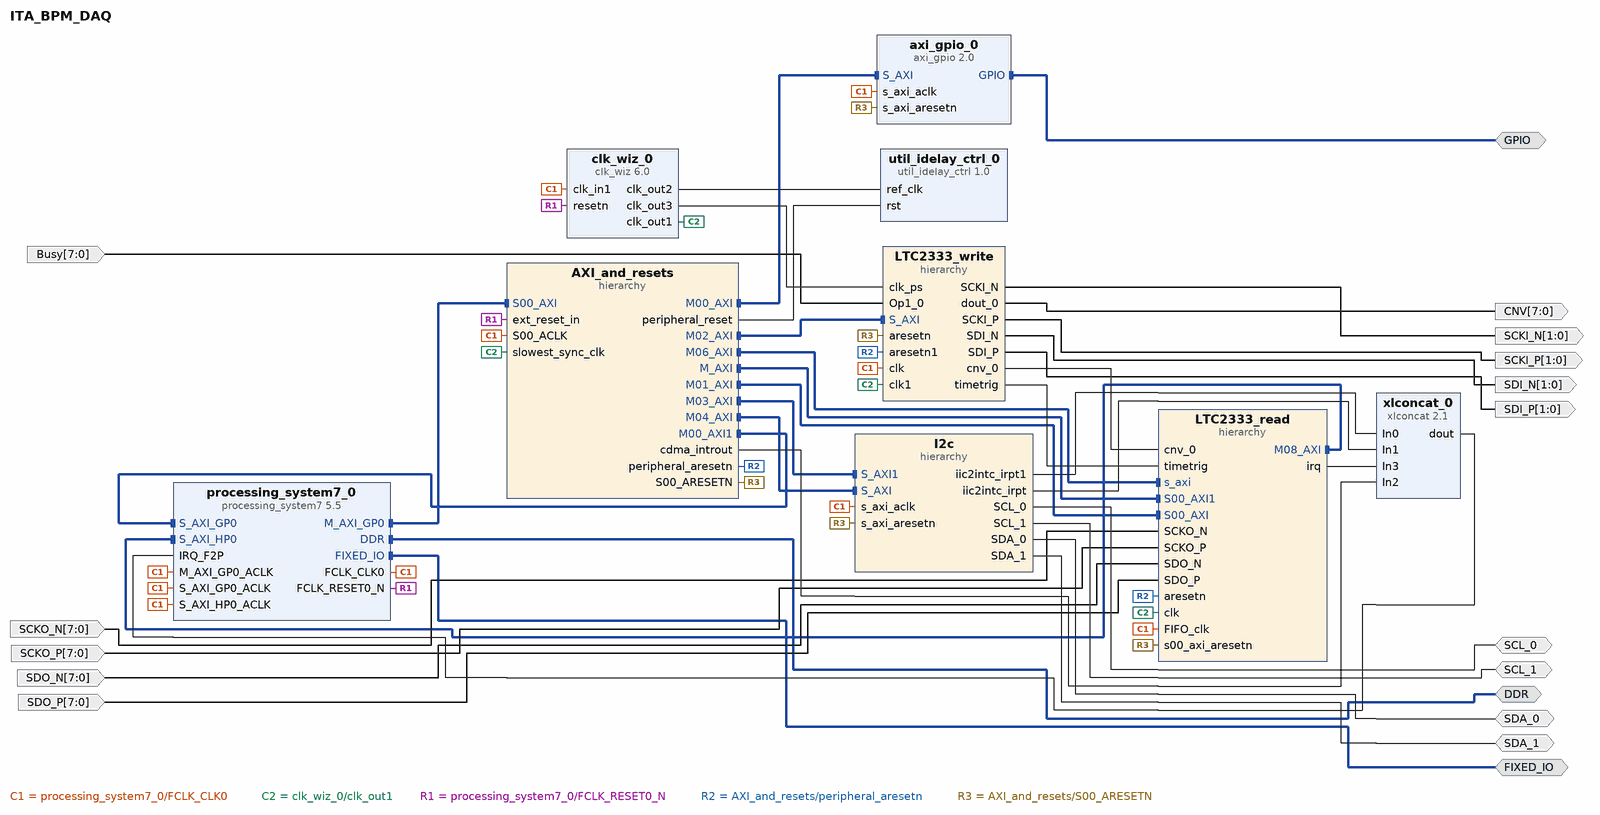
[diagram p0: block diagram of the top level]
# Vivado block design ITA_BPM_DAQ, xc7z020clg484-1, Vivado 2021.2
create_bd_design ITA_BPM_DAQ

create_bd_intf_port -mode Master -vlnv xilinx.com:interface:ddrx_rtl:1.0 DDR
create_bd_intf_port -mode Master -vlnv xilinx.com:display_processing_system7:fixedio_rtl:1.0 FIXED_IO
create_bd_intf_port -mode Master -vlnv xilinx.com:interface:gpio_rtl:1.0 GPIO
create_bd_port -dir I -from 7 -to 0 Busy
create_bd_port -dir I -from 7 -to 0 SCKO_P
create_bd_port -dir I -from 7 -to 0 SCKO_N
create_bd_port -dir I -from 7 -to 0 SDO_P
create_bd_port -dir I -from 7 -to 0 SDO_N
create_bd_port -dir O -from 1 -to 0 -type clk SCKI_P
create_bd_port -dir O -from 1 -to 0 -type clk SCKI_N
create_bd_port -dir O -from 1 -to 0 -type clk SDI_P
create_bd_port -dir O -from 1 -to 0 -type clk SDI_N
create_bd_port -dir O -from 7 -to 0 CNV
create_bd_port -dir IO SCL_0
create_bd_port -dir IO SDA_0
create_bd_port -dir IO SCL_1
create_bd_port -dir IO SDA_1

create_bd_cell -type ip -vlnv xilinx.com:ip:processing_system7:5.5 processing_system7_0
set_property -dict [list \
  CONFIG.PCW_EN_CLK1_PORT 1 \
  CONFIG.PCW_FCLK_CLK1_BUF TRUE \
  CONFIG.PCW_FPGA0_PERIPHERAL_FREQMHZ 100 \
  CONFIG.PCW_FPGA1_PERIPHERAL_FREQMHZ 33 \
  CONFIG.PCW_FPGA_FCLK1_ENABLE 1 \
  CONFIG.PCW_IRQ_F2P_INTR 1 \
  CONFIG.PCW_USE_FABRIC_INTERRUPT 1 \
  CONFIG.PCW_USE_S_AXI_GP0 1 \
  CONFIG.PCW_USE_S_AXI_HP0 1 \
] [get_bd_cells processing_system7_0]
# 34 more settings of processing_system7_0 are not shown: defaults, MIO pin electricals, DDR timing, and values the tool derives
create_bd_cell -type ip -vlnv xilinx.com:ip:axi_gpio:2.0 axi_gpio_0
set_property -dict {CONFIG.C_ALL_OUTPUTS 1 CONFIG.C_GPIO_WIDTH 6} [get_bd_cells axi_gpio_0]
create_bd_cell -type hier LTC2333_write
create_bd_cell -type hier AXI_and_resets
create_bd_cell -type hier LTC2333_read
create_bd_cell -type ip -vlnv xilinx.com:ip:xlconcat:2.1 xlconcat_0
set_property -dict {CONFIG.NUM_PORTS 4} [get_bd_cells xlconcat_0]
create_bd_cell -type hier I2c
create_bd_cell -type ip -vlnv xilinx.com:ip:clk_wiz:6.0 clk_wiz_0
set_property -dict [list \
  CONFIG.CLKOUT1_JITTER 165.726 \
  CONFIG.CLKOUT1_REQUESTED_OUT_FREQ 33.33333 \
  CONFIG.CLKOUT2_JITTER 114.829 \
  CONFIG.CLKOUT2_PHASE_ERROR 98.575 \
  CONFIG.CLKOUT2_REQUESTED_OUT_FREQ 200.000 \
  CONFIG.CLKOUT2_USED true \
  CONFIG.CLKOUT3_JITTER 165.726 \
  CONFIG.CLKOUT3_PHASE_ERROR 98.575 \
  CONFIG.CLKOUT3_REQUESTED_OUT_FREQ 33.33333 \
  CONFIG.CLKOUT3_REQUESTED_PHASE 90 \
  CONFIG.CLKOUT3_USED true \
  CONFIG.MMCM_CLKOUT0_DIVIDE_F 30.000 \
  CONFIG.MMCM_CLKOUT1_DIVIDE 5 \
  CONFIG.MMCM_CLKOUT2_DIVIDE 30 \
  CONFIG.MMCM_CLKOUT2_PHASE 90.000 \
  CONFIG.NUM_OUT_CLKS 3 \
  CONFIG.RESET_PORT resetn \
  CONFIG.RESET_TYPE ACTIVE_LOW \
] [get_bd_cells clk_wiz_0]
create_bd_cell -type ip -vlnv xilinx.com:ip:util_idelay_ctrl:1.0 util_idelay_ctrl_0

# ---- hierarchy /LTC2333_write ----
current_bd_instance /LTC2333_write
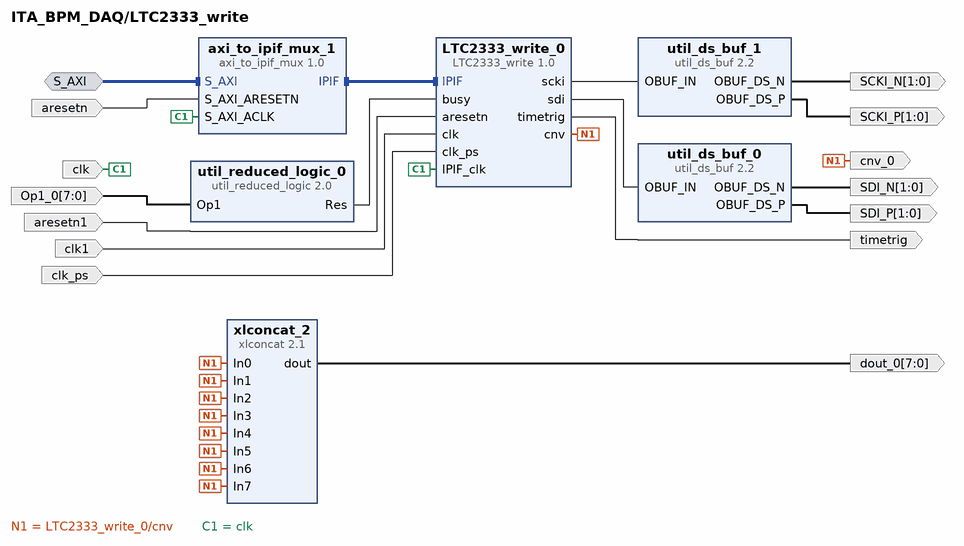
[diagram p1: block diagram inside /LTC2333_write]
create_bd_intf_pin -mode Slave -vlnv xilinx.com:interface:aximm_rtl:1.0 S_AXI
create_bd_pin -dir I -type clk clk
create_bd_pin -dir I -type rst aresetn
create_bd_pin -dir O cnv_0
create_bd_pin -dir I -type rst aresetn1
create_bd_pin -dir I -type clk clk1
create_bd_pin -dir I -from 7 -to 0 Op1_0
create_bd_pin -dir O -from 1 -to 0 -type clk SCKI_P
create_bd_pin -dir O -from 1 -to 0 -type clk SCKI_N
create_bd_pin -dir O -from 1 -to 0 -type clk SDI_P
create_bd_pin -dir O -from 1 -to 0 -type clk SDI_N
create_bd_pin -dir O -from 7 -to 0 dout_0
create_bd_pin -dir I clk_ps
create_bd_pin -dir O timetrig

create_bd_cell -type ip -vlnv user.org:user:axi_to_ipif_mux:1.0 axi_to_ipif_mux_1
set_property -dict {CONFIG.MUX_BY_CHIP false CONFIG.N_CHIP 1} [get_bd_cells axi_to_ipif_mux_1]
create_bd_cell -type ip -vlnv xilinx.com:ip:util_reduced_logic:2.0 util_reduced_logic_0
set_property -dict {CONFIG.C_OPERATION or} [get_bd_cells util_reduced_logic_0]
create_bd_cell -type ip -vlnv xilinx.com:ip:util_ds_buf:2.2 util_ds_buf_0
set_property -dict {CONFIG.C_BUF_TYPE OBUFDS CONFIG.C_SIZE 2} [get_bd_cells util_ds_buf_0]
create_bd_cell -type ip -vlnv xilinx.com:ip:util_ds_buf:2.2 util_ds_buf_1
set_property -dict {CONFIG.C_BUF_TYPE OBUFDS CONFIG.C_SIZE 2} [get_bd_cells util_ds_buf_1]
create_bd_cell -type ip -vlnv xilinx.com:ip:xlconcat:2.1 xlconcat_2
set_property -dict {CONFIG.NUM_PORTS 8} [get_bd_cells xlconcat_2]
create_bd_cell -type ip -vlnv user.org:user:LTC2333_write:1.0 LTC2333_write_0
set_property -dict {CONFIG.BUSY_SIGNAL 0 CONFIG.BUSY_TIME 600 CONFIG.CLOCK_PERIOD 30} [get_bd_cells LTC2333_write_0]

# ---- hierarchy /AXI_and_resets ----
current_bd_instance /AXI_and_resets
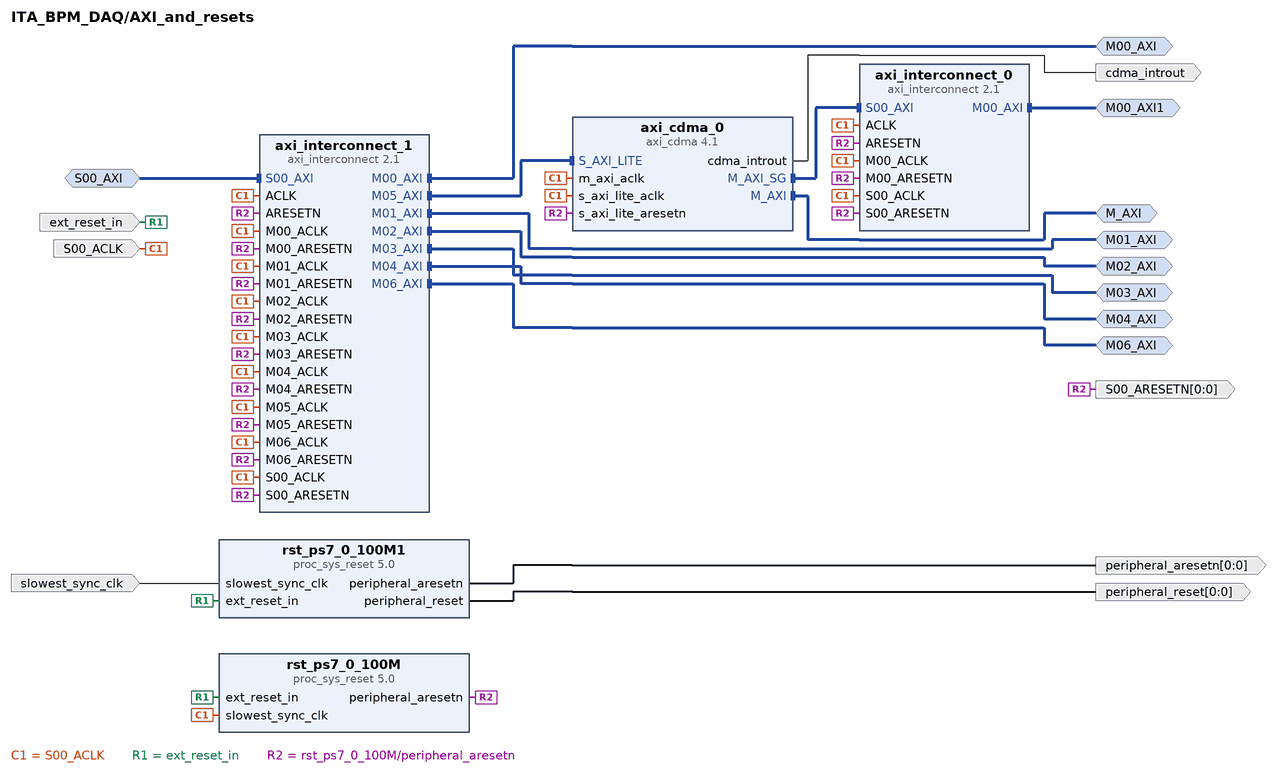
[diagram p2: block diagram inside /AXI_and_resets]
create_bd_intf_pin -mode Master -vlnv xilinx.com:interface:aximm_rtl:1.0 M00_AXI
create_bd_intf_pin -mode Master -vlnv xilinx.com:interface:aximm_rtl:1.0 M01_AXI
create_bd_intf_pin -mode Master -vlnv xilinx.com:interface:aximm_rtl:1.0 M02_AXI
create_bd_intf_pin -mode Master -vlnv xilinx.com:interface:aximm_rtl:1.0 M03_AXI
create_bd_intf_pin -mode Master -vlnv xilinx.com:interface:aximm_rtl:1.0 M04_AXI
create_bd_intf_pin -mode Master -vlnv xilinx.com:interface:aximm_rtl:1.0 M00_AXI1
create_bd_intf_pin -mode Master -vlnv xilinx.com:interface:aximm_rtl:1.0 M_AXI
create_bd_intf_pin -mode Slave -vlnv xilinx.com:interface:aximm_rtl:1.0 S00_AXI
create_bd_intf_pin -mode Master -vlnv xilinx.com:interface:aximm_rtl:1.0 M06_AXI
create_bd_pin -dir I -type clk S00_ACLK
create_bd_pin -dir I -type rst ext_reset_in
create_bd_pin -dir O -from 0 -to 0 -type rst S00_ARESETN
create_bd_pin -dir I -type clk slowest_sync_clk
create_bd_pin -dir O -from 0 -to 0 -type rst peripheral_aresetn
create_bd_pin -dir O -from 0 -to 0 -type rst peripheral_reset
create_bd_pin -dir O -type intr cdma_introut

create_bd_cell -type ip -vlnv xilinx.com:ip:proc_sys_reset:5.0 rst_ps7_0_100M
create_bd_cell -type ip -vlnv xilinx.com:ip:proc_sys_reset:5.0 rst_ps7_0_100M1
create_bd_cell -type ip -vlnv xilinx.com:ip:axi_cdma:4.1 axi_cdma_0
set_property -dict {CONFIG.C_INCLUDE_SF 0 CONFIG.C_M_AXI_MAX_BURST_LEN 32} [get_bd_cells axi_cdma_0]
create_bd_cell -type ip -vlnv xilinx.com:ip:axi_interconnect:2.1 axi_interconnect_0
set_property -dict {CONFIG.NUM_MI 1} [get_bd_cells axi_interconnect_0]
create_bd_cell -type ip -vlnv xilinx.com:ip:axi_interconnect:2.1 axi_interconnect_1
set_property -dict {CONFIG.NUM_MI 7} [get_bd_cells axi_interconnect_1]

# ---- hierarchy /LTC2333_read ----
current_bd_instance /LTC2333_read
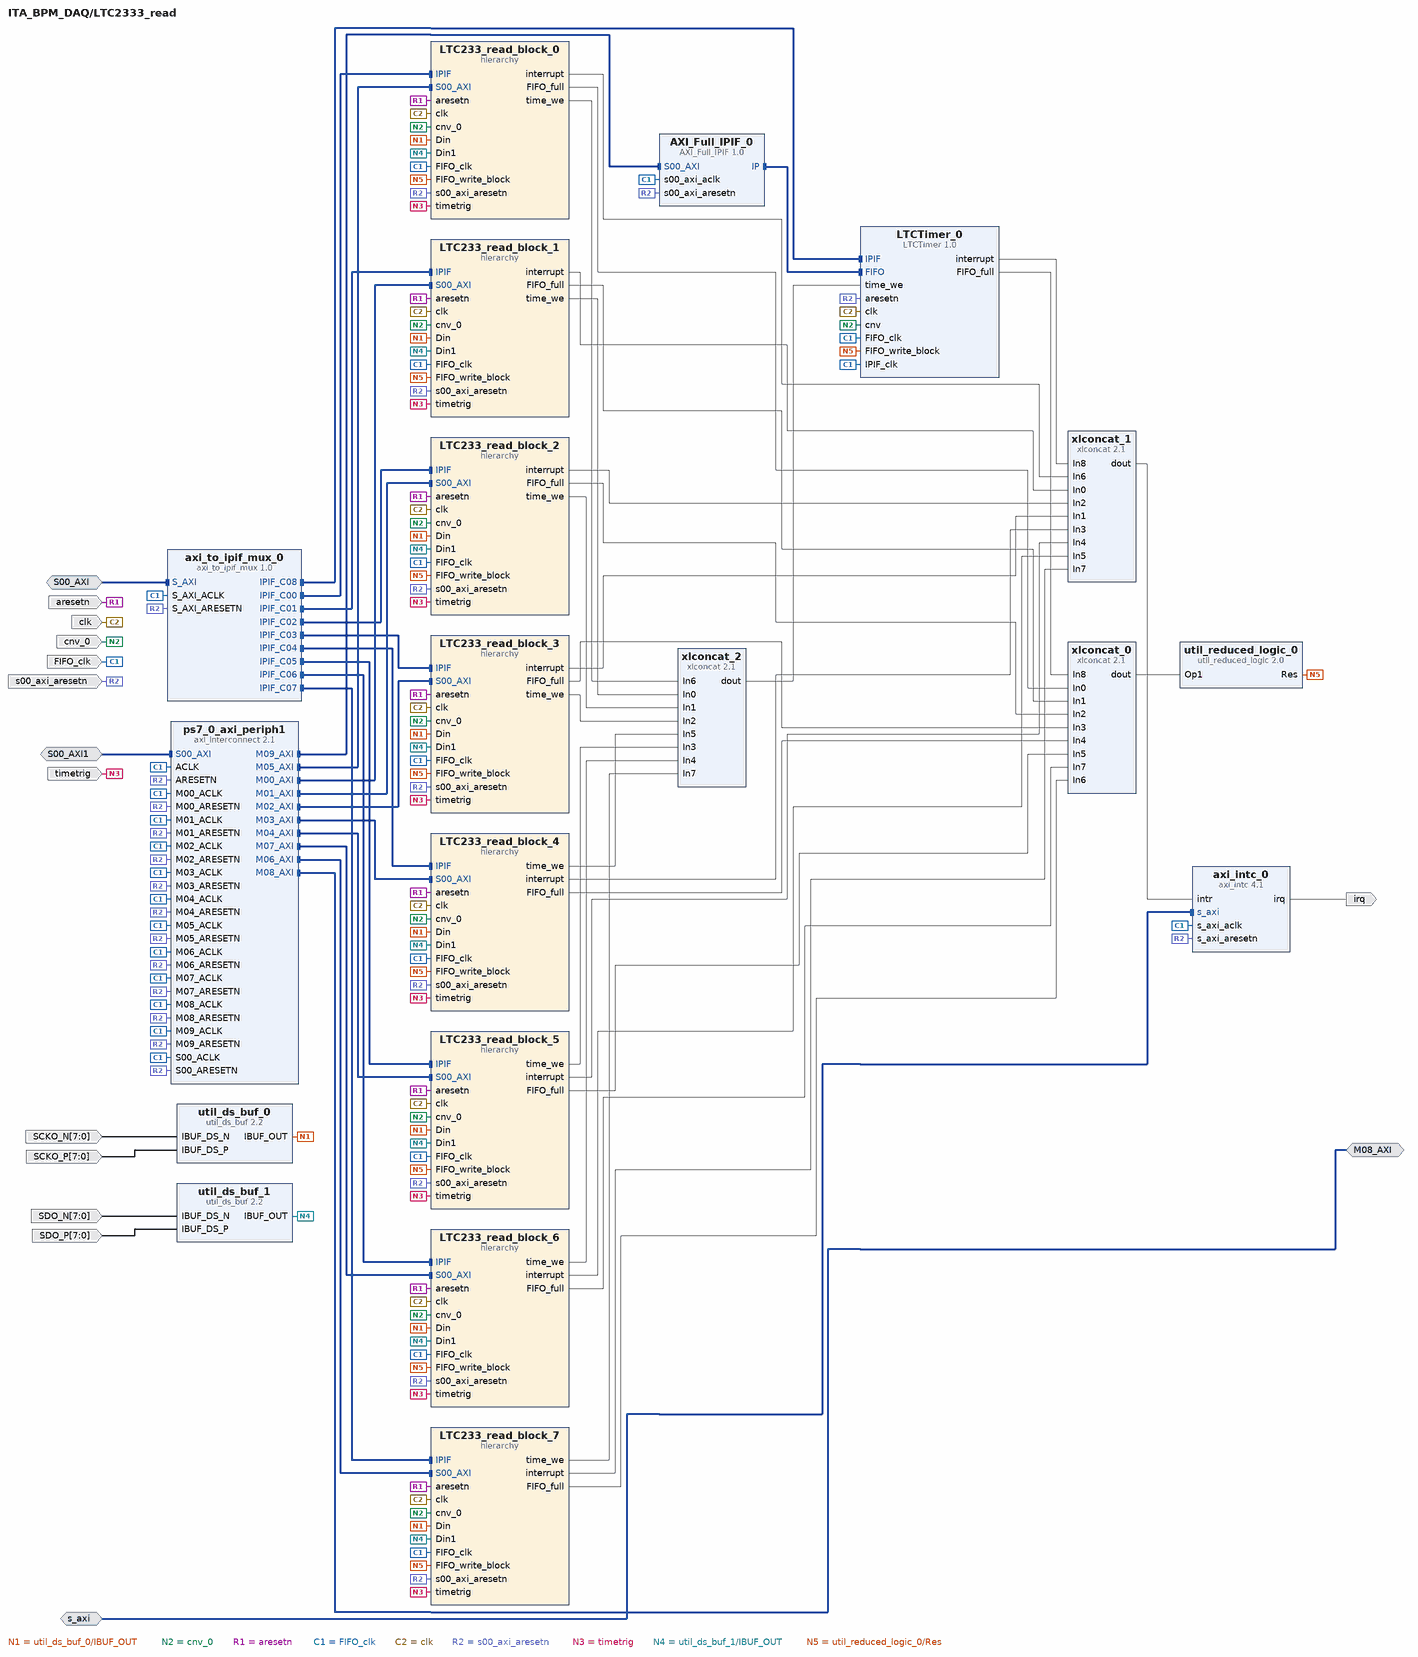
[diagram p3: block diagram inside /LTC2333_read]
create_bd_intf_pin -mode Slave -vlnv xilinx.com:interface:aximm_rtl:1.0 S00_AXI
create_bd_intf_pin -mode Slave -vlnv xilinx.com:interface:aximm_rtl:1.0 S00_AXI1
create_bd_intf_pin -mode Master -vlnv xilinx.com:interface:aximm_rtl:1.0 M08_AXI
create_bd_intf_pin -mode Slave -vlnv xilinx.com:interface:aximm_rtl:1.0 s_axi
create_bd_pin -dir I -type clk FIFO_clk
create_bd_pin -dir I -type rst s00_axi_aresetn
create_bd_pin -dir I -type clk clk
create_bd_pin -dir I cnv_0
create_bd_pin -dir I -type rst aresetn
create_bd_pin -dir I -from 7 -to 0 -type clk SCKO_P
create_bd_pin -dir I -from 7 -to 0 -type clk SCKO_N
create_bd_pin -dir I -from 7 -to 0 -type clk SDO_P
create_bd_pin -dir I -from 7 -to 0 -type clk SDO_N
create_bd_pin -dir I timetrig
create_bd_pin -dir O -type intr irq

create_bd_cell -type ip -vlnv user.org:user:axi_to_ipif_mux:1.0 axi_to_ipif_mux_0
set_property -dict {CONFIG.BROADCAST_REG 13 CONFIG.N_CHIP 9} [get_bd_cells axi_to_ipif_mux_0]
create_bd_cell -type hier LTC233_read_block_0
create_bd_cell -type ip -vlnv xilinx.com:ip:axi_interconnect:2.1 ps7_0_axi_periph1
set_property -dict {CONFIG.NUM_MI 10} [get_bd_cells ps7_0_axi_periph1]
create_bd_cell -type hier LTC233_read_block_2
create_bd_cell -type hier LTC233_read_block_3
create_bd_cell -type hier LTC233_read_block_4
create_bd_cell -type hier LTC233_read_block_5
create_bd_cell -type hier LTC233_read_block_6
create_bd_cell -type hier LTC233_read_block_7
create_bd_cell -type hier LTC233_read_block_1
create_bd_cell -type ip -vlnv xilinx.com:ip:util_reduced_logic:2.0 util_reduced_logic_0
set_property -dict {CONFIG.C_OPERATION or CONFIG.C_SIZE 9} [get_bd_cells util_reduced_logic_0]
create_bd_cell -type ip -vlnv xilinx.com:ip:xlconcat:2.1 xlconcat_0
set_property -dict {CONFIG.NUM_PORTS 9} [get_bd_cells xlconcat_0]
create_bd_cell -type ip -vlnv xilinx.com:ip:util_ds_buf:2.2 util_ds_buf_0
set_property -dict {CONFIG.C_SIZE 8} [get_bd_cells util_ds_buf_0]
create_bd_cell -type ip -vlnv xilinx.com:ip:util_ds_buf:2.2 util_ds_buf_1
set_property -dict {CONFIG.C_SIZE 8} [get_bd_cells util_ds_buf_1]
create_bd_cell -type ip -vlnv user.org:user:AXI_Full_IPIF:1.0 AXI_Full_IPIF_0
create_bd_cell -type ip -vlnv xilinx.com:ip:axi_intc:4.1 axi_intc_0
set_property -dict [list \
  CONFIG.C_HAS_CIE 0 \
  CONFIG.C_HAS_IPR 0 \
  CONFIG.C_HAS_IVR 0 \
  CONFIG.C_HAS_SIE 0 \
  CONFIG.C_IRQ_CONNECTION 1 \
  CONFIG.C_NUM_SW_INTR 0 \
] [get_bd_cells axi_intc_0]
create_bd_cell -type ip -vlnv xilinx.com:ip:xlconcat:2.1 xlconcat_1
set_property -dict {CONFIG.NUM_PORTS 9} [get_bd_cells xlconcat_1]
create_bd_cell -type ip -vlnv xilinx.com:ip:xlconcat:2.1 xlconcat_2
set_property -dict {CONFIG.NUM_PORTS 8} [get_bd_cells xlconcat_2]
create_bd_cell -type ip -vlnv user.org:user:LTCTimer:1.0 LTCTimer_0
set_property -dict {CONFIG.C_S_AXI_DATA_WIDTH 32} [get_bd_cells LTCTimer_0]

# ---- hierarchy /LTC2333_read/LTC233_read_block_0 ----
current_bd_instance /LTC2333_read/LTC233_read_block_0
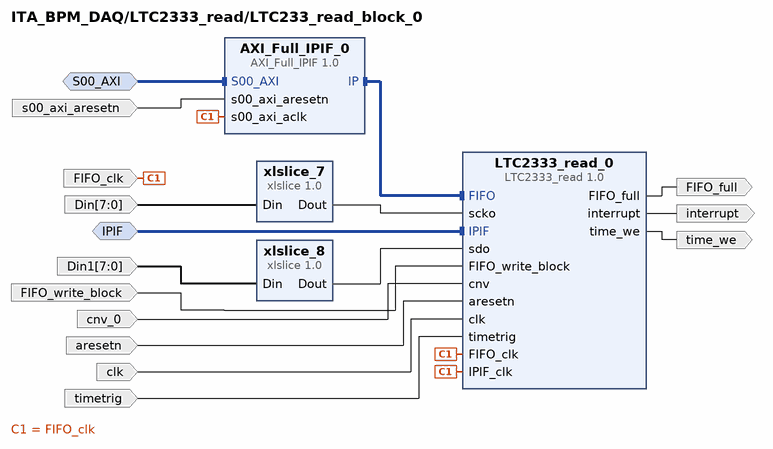
[diagram p4: block diagram inside /LTC2333_read/LTC233_read_block_0]
create_bd_intf_pin -mode Slave -vlnv NONE:user:IPIF_AXISL__rtl:1.0 IPIF
create_bd_intf_pin -mode Slave -vlnv xilinx.com:interface:aximm_rtl:1.0 S00_AXI
create_bd_pin -dir I -type clk clk
create_bd_pin -dir I cnv_0
create_bd_pin -dir I -type clk FIFO_clk
create_bd_pin -dir I -type rst s00_axi_aresetn
create_bd_pin -dir I -type rst aresetn
create_bd_pin -dir O FIFO_full
create_bd_pin -dir I FIFO_write_block
create_bd_pin -dir I -from 7 -to 0 Din
create_bd_pin -dir I -from 7 -to 0 Din1
create_bd_pin -dir I timetrig
create_bd_pin -dir O -type intr interrupt
create_bd_pin -dir O time_we

create_bd_cell -type ip -vlnv user.org:user:AXI_Full_IPIF:1.0 AXI_Full_IPIF_0
create_bd_cell -type ip -vlnv xilinx.com:ip:xlslice:1.0 xlslice_7
set_property -dict {CONFIG.DIN_WIDTH 8} [get_bd_cells xlslice_7]
create_bd_cell -type ip -vlnv xilinx.com:ip:xlslice:1.0 xlslice_8
set_property -dict {CONFIG.DIN_WIDTH 8} [get_bd_cells xlslice_8]
create_bd_cell -type ip -vlnv user.org:user:LTC2333_read:1.0 LTC2333_read_0

# ---- hierarchy /LTC2333_read/LTC233_read_block_2 ----
current_bd_instance /LTC2333_read/LTC233_read_block_2
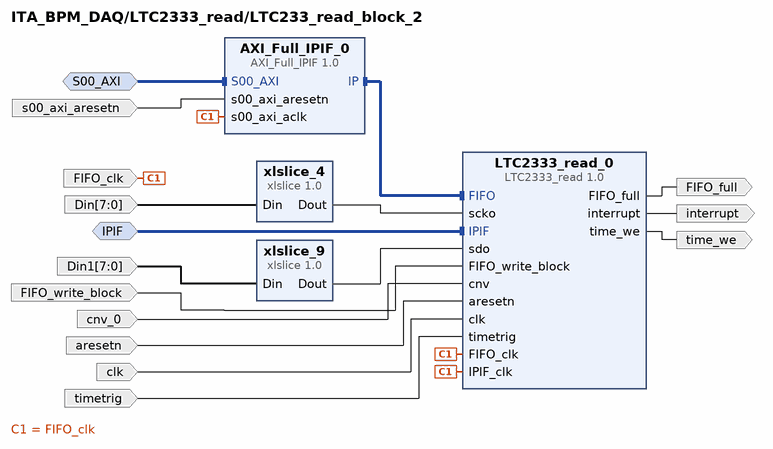
[diagram p5: block diagram inside /LTC2333_read/LTC233_read_block_2]
create_bd_intf_pin -mode Slave -vlnv NONE:user:IPIF_AXISL__rtl:1.0 IPIF
create_bd_intf_pin -mode Slave -vlnv xilinx.com:interface:aximm_rtl:1.0 S00_AXI
create_bd_pin -dir I -type clk clk
create_bd_pin -dir I cnv_0
create_bd_pin -dir I -type clk FIFO_clk
create_bd_pin -dir I -type rst s00_axi_aresetn
create_bd_pin -dir I -type rst aresetn
create_bd_pin -dir O FIFO_full
create_bd_pin -dir I FIFO_write_block
create_bd_pin -dir I -from 7 -to 0 Din
create_bd_pin -dir I -from 7 -to 0 Din1
create_bd_pin -dir I timetrig
create_bd_pin -dir O -type intr interrupt
create_bd_pin -dir O time_we

create_bd_cell -type ip -vlnv user.org:user:AXI_Full_IPIF:1.0 AXI_Full_IPIF_0
create_bd_cell -type ip -vlnv xilinx.com:ip:xlslice:1.0 xlslice_4
set_property -dict {CONFIG.DIN_FROM 1 CONFIG.DIN_TO 1 CONFIG.DIN_WIDTH 8 CONFIG.DOUT_WIDTH 1} [get_bd_cells xlslice_4]
create_bd_cell -type ip -vlnv xilinx.com:ip:xlslice:1.0 xlslice_9
set_property -dict {CONFIG.DIN_FROM 1 CONFIG.DIN_TO 1 CONFIG.DIN_WIDTH 8 CONFIG.DOUT_WIDTH 1} [get_bd_cells xlslice_9]
create_bd_cell -type ip -vlnv user.org:user:LTC2333_read:1.0 LTC2333_read_0

# ---- hierarchy /LTC2333_read/LTC233_read_block_3 ----
current_bd_instance /LTC2333_read/LTC233_read_block_3
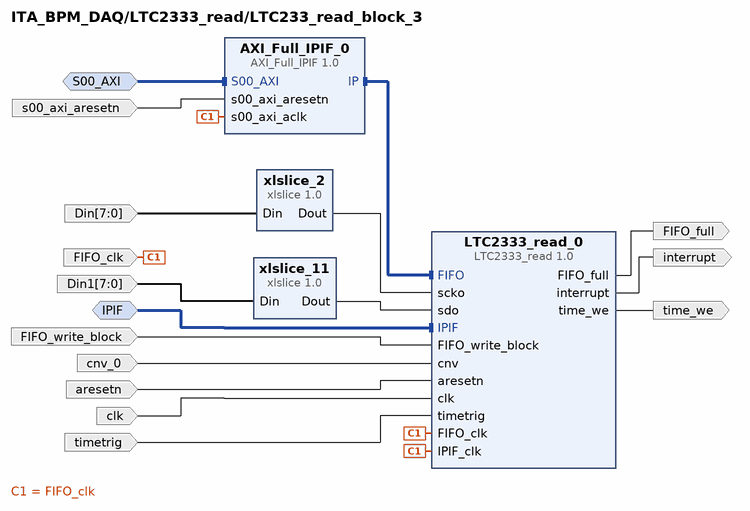
[diagram p6: block diagram inside /LTC2333_read/LTC233_read_block_3]
create_bd_intf_pin -mode Slave -vlnv NONE:user:IPIF_AXISL__rtl:1.0 IPIF
create_bd_intf_pin -mode Slave -vlnv xilinx.com:interface:aximm_rtl:1.0 S00_AXI
create_bd_pin -dir I -type clk clk
create_bd_pin -dir I cnv_0
create_bd_pin -dir I -type clk FIFO_clk
create_bd_pin -dir I -type rst s00_axi_aresetn
create_bd_pin -dir I -type rst aresetn
create_bd_pin -dir O FIFO_full
create_bd_pin -dir I FIFO_write_block
create_bd_pin -dir I -from 7 -to 0 Din
create_bd_pin -dir I -from 7 -to 0 Din1
create_bd_pin -dir I timetrig
create_bd_pin -dir O -type intr interrupt
create_bd_pin -dir O time_we

create_bd_cell -type ip -vlnv user.org:user:AXI_Full_IPIF:1.0 AXI_Full_IPIF_0
create_bd_cell -type ip -vlnv xilinx.com:ip:xlslice:1.0 xlslice_2
set_property -dict {CONFIG.DIN_FROM 3 CONFIG.DIN_TO 3 CONFIG.DIN_WIDTH 8 CONFIG.DOUT_WIDTH 1} [get_bd_cells xlslice_2]
create_bd_cell -type ip -vlnv xilinx.com:ip:xlslice:1.0 xlslice_11
set_property -dict {CONFIG.DIN_FROM 3 CONFIG.DIN_TO 3 CONFIG.DIN_WIDTH 8 CONFIG.DOUT_WIDTH 1} [get_bd_cells xlslice_11]
create_bd_cell -type ip -vlnv user.org:user:LTC2333_read:1.0 LTC2333_read_0

# ---- hierarchy /LTC2333_read/LTC233_read_block_4 ----
current_bd_instance /LTC2333_read/LTC233_read_block_4
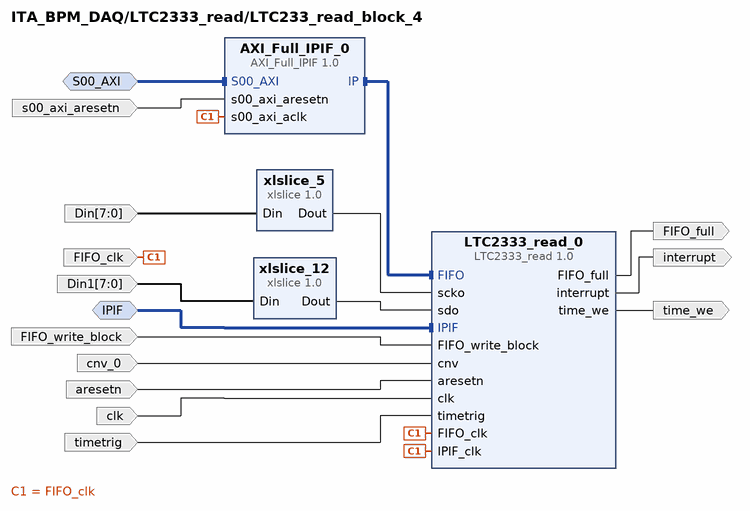
[diagram p7: block diagram inside /LTC2333_read/LTC233_read_block_4]
create_bd_intf_pin -mode Slave -vlnv NONE:user:IPIF_AXISL__rtl:1.0 IPIF
create_bd_intf_pin -mode Slave -vlnv xilinx.com:interface:aximm_rtl:1.0 S00_AXI
create_bd_pin -dir I -type clk clk
create_bd_pin -dir I cnv_0
create_bd_pin -dir I -type clk FIFO_clk
create_bd_pin -dir I -type rst s00_axi_aresetn
create_bd_pin -dir I -type rst aresetn
create_bd_pin -dir O FIFO_full
create_bd_pin -dir I FIFO_write_block
create_bd_pin -dir I -from 7 -to 0 Din
create_bd_pin -dir I -from 7 -to 0 Din1
create_bd_pin -dir I timetrig
create_bd_pin -dir O -type intr interrupt
create_bd_pin -dir O time_we

create_bd_cell -type ip -vlnv user.org:user:AXI_Full_IPIF:1.0 AXI_Full_IPIF_0
create_bd_cell -type ip -vlnv xilinx.com:ip:xlslice:1.0 xlslice_5
set_property -dict {CONFIG.DIN_FROM 4 CONFIG.DIN_TO 4 CONFIG.DIN_WIDTH 8 CONFIG.DOUT_WIDTH 1} [get_bd_cells xlslice_5]
create_bd_cell -type ip -vlnv xilinx.com:ip:xlslice:1.0 xlslice_12
set_property -dict {CONFIG.DIN_FROM 4 CONFIG.DIN_TO 4 CONFIG.DIN_WIDTH 8 CONFIG.DOUT_WIDTH 1} [get_bd_cells xlslice_12]
create_bd_cell -type ip -vlnv user.org:user:LTC2333_read:1.0 LTC2333_read_0

# ---- hierarchy /LTC2333_read/LTC233_read_block_5 ----
current_bd_instance /LTC2333_read/LTC233_read_block_5
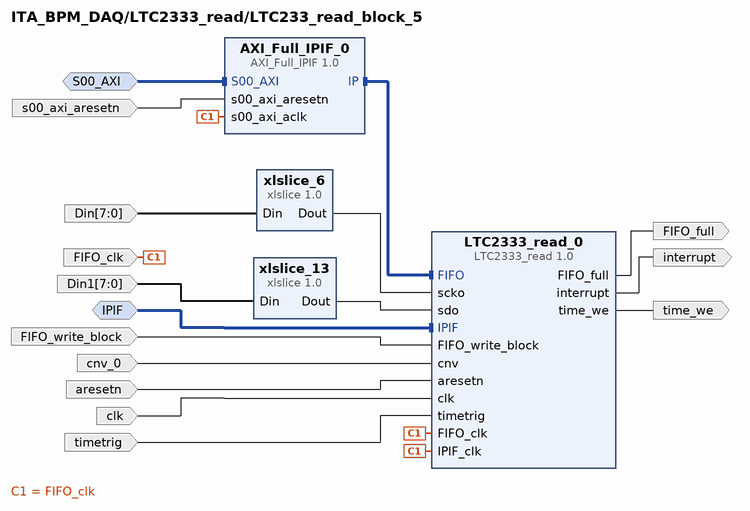
[diagram p8: block diagram inside /LTC2333_read/LTC233_read_block_5]
create_bd_intf_pin -mode Slave -vlnv NONE:user:IPIF_AXISL__rtl:1.0 IPIF
create_bd_intf_pin -mode Slave -vlnv xilinx.com:interface:aximm_rtl:1.0 S00_AXI
create_bd_pin -dir I -type clk clk
create_bd_pin -dir I cnv_0
create_bd_pin -dir I -type clk FIFO_clk
create_bd_pin -dir I -type rst s00_axi_aresetn
create_bd_pin -dir I -type rst aresetn
create_bd_pin -dir O FIFO_full
create_bd_pin -dir I FIFO_write_block
create_bd_pin -dir I -from 7 -to 0 Din
create_bd_pin -dir I -from 7 -to 0 Din1
create_bd_pin -dir I timetrig
create_bd_pin -dir O -type intr interrupt
create_bd_pin -dir O time_we

create_bd_cell -type ip -vlnv user.org:user:AXI_Full_IPIF:1.0 AXI_Full_IPIF_0
create_bd_cell -type ip -vlnv xilinx.com:ip:xlslice:1.0 xlslice_6
set_property -dict {CONFIG.DIN_FROM 5 CONFIG.DIN_TO 5 CONFIG.DIN_WIDTH 8 CONFIG.DOUT_WIDTH 1} [get_bd_cells xlslice_6]
create_bd_cell -type ip -vlnv xilinx.com:ip:xlslice:1.0 xlslice_13
set_property -dict {CONFIG.DIN_FROM 5 CONFIG.DIN_TO 5 CONFIG.DIN_WIDTH 8 CONFIG.DOUT_WIDTH 1} [get_bd_cells xlslice_13]
create_bd_cell -type ip -vlnv user.org:user:LTC2333_read:1.0 LTC2333_read_0

# ---- hierarchy /LTC2333_read/LTC233_read_block_6 ----
current_bd_instance /LTC2333_read/LTC233_read_block_6
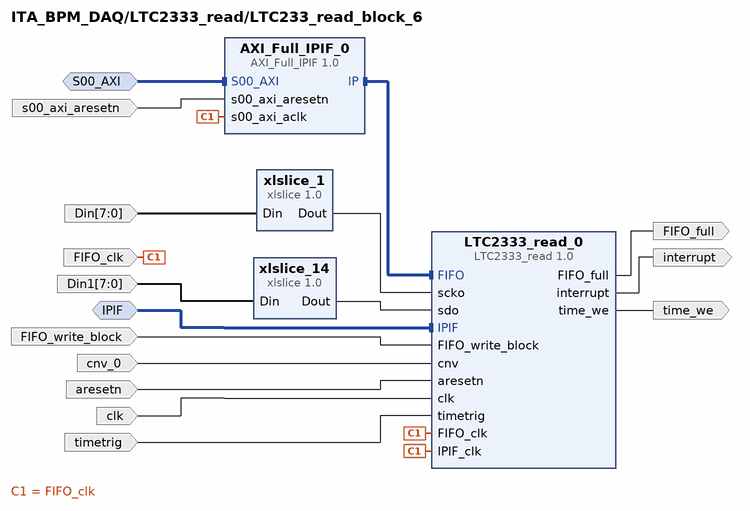
[diagram p9: block diagram inside /LTC2333_read/LTC233_read_block_6]
create_bd_intf_pin -mode Slave -vlnv NONE:user:IPIF_AXISL__rtl:1.0 IPIF
create_bd_intf_pin -mode Slave -vlnv xilinx.com:interface:aximm_rtl:1.0 S00_AXI
create_bd_pin -dir I -type clk clk
create_bd_pin -dir I cnv_0
create_bd_pin -dir I -type clk FIFO_clk
create_bd_pin -dir I -type rst s00_axi_aresetn
create_bd_pin -dir I -type rst aresetn
create_bd_pin -dir O FIFO_full
create_bd_pin -dir I FIFO_write_block
create_bd_pin -dir I -from 7 -to 0 Din
create_bd_pin -dir I -from 7 -to 0 Din1
create_bd_pin -dir I timetrig
create_bd_pin -dir O -type intr interrupt
create_bd_pin -dir O time_we

create_bd_cell -type ip -vlnv user.org:user:AXI_Full_IPIF:1.0 AXI_Full_IPIF_0
create_bd_cell -type ip -vlnv xilinx.com:ip:xlslice:1.0 xlslice_1
set_property -dict {CONFIG.DIN_FROM 6 CONFIG.DIN_TO 6 CONFIG.DIN_WIDTH 8 CONFIG.DOUT_WIDTH 1} [get_bd_cells xlslice_1]
create_bd_cell -type ip -vlnv xilinx.com:ip:xlslice:1.0 xlslice_14
set_property -dict {CONFIG.DIN_FROM 6 CONFIG.DIN_TO 6 CONFIG.DIN_WIDTH 8 CONFIG.DOUT_WIDTH 1} [get_bd_cells xlslice_14]
create_bd_cell -type ip -vlnv user.org:user:LTC2333_read:1.0 LTC2333_read_0

# ---- hierarchy /LTC2333_read/LTC233_read_block_7 ----
current_bd_instance /LTC2333_read/LTC233_read_block_7
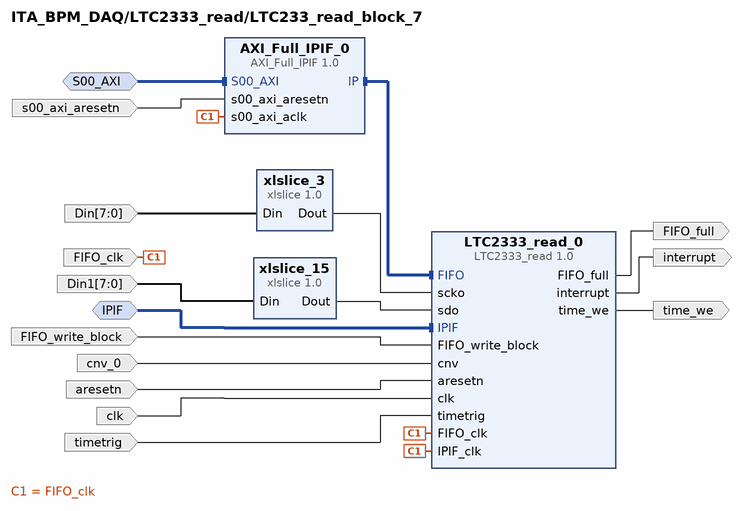
[diagram p10: block diagram inside /LTC2333_read/LTC233_read_block_7]
create_bd_intf_pin -mode Slave -vlnv NONE:user:IPIF_AXISL__rtl:1.0 IPIF
create_bd_intf_pin -mode Slave -vlnv xilinx.com:interface:aximm_rtl:1.0 S00_AXI
create_bd_pin -dir I -type clk clk
create_bd_pin -dir I cnv_0
create_bd_pin -dir I -type clk FIFO_clk
create_bd_pin -dir I -type rst s00_axi_aresetn
create_bd_pin -dir I -type rst aresetn
create_bd_pin -dir O FIFO_full
create_bd_pin -dir I FIFO_write_block
create_bd_pin -dir I -from 7 -to 0 Din
create_bd_pin -dir I -from 7 -to 0 Din1
create_bd_pin -dir I timetrig
create_bd_pin -dir O -type intr interrupt
create_bd_pin -dir O time_we

create_bd_cell -type ip -vlnv user.org:user:AXI_Full_IPIF:1.0 AXI_Full_IPIF_0
create_bd_cell -type ip -vlnv xilinx.com:ip:xlslice:1.0 xlslice_3
set_property -dict {CONFIG.DIN_FROM 7 CONFIG.DIN_TO 7 CONFIG.DIN_WIDTH 8 CONFIG.DOUT_WIDTH 1} [get_bd_cells xlslice_3]
create_bd_cell -type ip -vlnv xilinx.com:ip:xlslice:1.0 xlslice_15
set_property -dict {CONFIG.DIN_FROM 7 CONFIG.DIN_TO 7 CONFIG.DIN_WIDTH 8 CONFIG.DOUT_WIDTH 1} [get_bd_cells xlslice_15]
create_bd_cell -type ip -vlnv user.org:user:LTC2333_read:1.0 LTC2333_read_0

# ---- hierarchy /LTC2333_read/LTC233_read_block_1 ----
current_bd_instance /LTC2333_read/LTC233_read_block_1
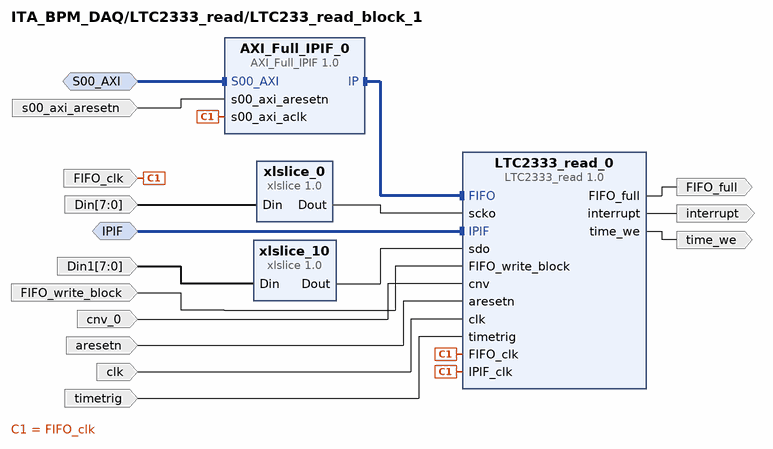
[diagram p11: block diagram inside /LTC2333_read/LTC233_read_block_1]
create_bd_intf_pin -mode Slave -vlnv NONE:user:IPIF_AXISL__rtl:1.0 IPIF
create_bd_intf_pin -mode Slave -vlnv xilinx.com:interface:aximm_rtl:1.0 S00_AXI
create_bd_pin -dir I -type clk clk
create_bd_pin -dir I cnv_0
create_bd_pin -dir I -type clk FIFO_clk
create_bd_pin -dir I -type rst s00_axi_aresetn
create_bd_pin -dir I -type rst aresetn
create_bd_pin -dir O FIFO_full
create_bd_pin -dir I FIFO_write_block
create_bd_pin -dir I -from 7 -to 0 Din
create_bd_pin -dir I -from 7 -to 0 Din1
create_bd_pin -dir I timetrig
create_bd_pin -dir O -type intr interrupt
create_bd_pin -dir O time_we

create_bd_cell -type ip -vlnv user.org:user:AXI_Full_IPIF:1.0 AXI_Full_IPIF_0
create_bd_cell -type ip -vlnv xilinx.com:ip:xlslice:1.0 xlslice_0
set_property -dict {CONFIG.DIN_FROM 2 CONFIG.DIN_TO 2 CONFIG.DIN_WIDTH 8 CONFIG.DOUT_WIDTH 1} [get_bd_cells xlslice_0]
create_bd_cell -type ip -vlnv xilinx.com:ip:xlslice:1.0 xlslice_10
set_property -dict {CONFIG.DIN_FROM 2 CONFIG.DIN_TO 2 CONFIG.DIN_WIDTH 8 CONFIG.DOUT_WIDTH 1} [get_bd_cells xlslice_10]
create_bd_cell -type ip -vlnv user.org:user:LTC2333_read:1.0 LTC2333_read_0

# ---- hierarchy /I2c ----
current_bd_instance /I2c
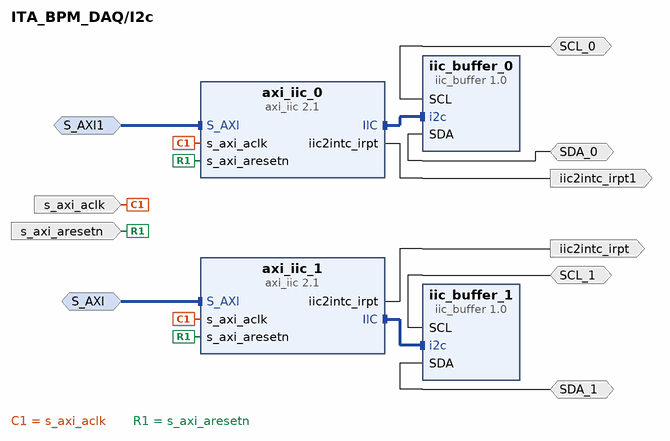
[diagram p12: block diagram inside /I2c]
create_bd_intf_pin -mode Slave -vlnv xilinx.com:interface:aximm_rtl:1.0 S_AXI
create_bd_intf_pin -mode Slave -vlnv xilinx.com:interface:aximm_rtl:1.0 S_AXI1
create_bd_pin -dir I -type clk s_axi_aclk
create_bd_pin -dir I -type rst s_axi_aresetn
create_bd_pin -dir O -type intr iic2intc_irpt
create_bd_pin -dir IO SCL_0
create_bd_pin -dir IO SDA_0
create_bd_pin -dir IO SCL_1
create_bd_pin -dir IO SDA_1
create_bd_pin -dir O -type intr iic2intc_irpt1

create_bd_cell -type ip -vlnv xilinx.com:ip:axi_iic:2.1 axi_iic_1
create_bd_cell -type ip -vlnv user.org:user:iic_buffer:1.0 iic_buffer_0
create_bd_cell -type ip -vlnv user.org:user:iic_buffer:1.0 iic_buffer_1
create_bd_cell -type ip -vlnv xilinx.com:ip:axi_iic:2.1 axi_iic_0

# ---- connections ----

current_bd_instance /LTC2333_write
connect_bd_intf_net [get_bd_intf_pins axi_to_ipif_mux_1/IPIF] [get_bd_intf_pins LTC2333_write_0/IPIF]
connect_bd_intf_net [get_bd_intf_pins S_AXI] [get_bd_intf_pins axi_to_ipif_mux_1/S_AXI]
connect_bd_net [get_bd_pins LTC2333_write_0/cnv] \
  [get_bd_pins cnv_0] [get_bd_pins xlconcat_2/In7] [get_bd_pins xlconcat_2/In6] [get_bd_pins xlconcat_2/In5] \
  [get_bd_pins xlconcat_2/In4] [get_bd_pins xlconcat_2/In3] [get_bd_pins xlconcat_2/In2] [get_bd_pins xlconcat_2/In1] \
  [get_bd_pins xlconcat_2/In0]
connect_bd_net [get_bd_pins LTC2333_write_0/scki] [get_bd_pins util_ds_buf_1/OBUF_IN]
connect_bd_net [get_bd_pins LTC2333_write_0/sdi] [get_bd_pins util_ds_buf_0/OBUF_IN]
connect_bd_net [get_bd_pins LTC2333_write_0/timetrig] [get_bd_pins timetrig]
connect_bd_net -net Op1_0_1 [get_bd_pins Op1_0] [get_bd_pins util_reduced_logic_0/Op1]
connect_bd_net -net aresetn1_1 [get_bd_pins aresetn1] [get_bd_pins LTC2333_write_0/aresetn]
connect_bd_net -net clk1_1 [get_bd_pins clk1] [get_bd_pins LTC2333_write_0/clk]
connect_bd_net [get_bd_pins clk_ps] [get_bd_pins LTC2333_write_0/clk_ps]
connect_bd_net -net processing_system7_0_FCLK_CLK0 [get_bd_pins clk] [get_bd_pins axi_to_ipif_mux_1/S_AXI_ACLK] [get_bd_pins LTC2333_write_0/IPIF_clk]
connect_bd_net -net rst_ps7_0_100M_peripheral_aresetn [get_bd_pins aresetn] [get_bd_pins axi_to_ipif_mux_1/S_AXI_ARESETN]
connect_bd_net [get_bd_pins util_ds_buf_0/OBUF_DS_N] [get_bd_pins SDI_N]
connect_bd_net [get_bd_pins util_ds_buf_0/OBUF_DS_P] [get_bd_pins SDI_P]
connect_bd_net [get_bd_pins util_ds_buf_1/OBUF_DS_N] [get_bd_pins SCKI_N]
connect_bd_net [get_bd_pins util_ds_buf_1/OBUF_DS_P] [get_bd_pins SCKI_P]
connect_bd_net [get_bd_pins util_reduced_logic_0/Res] [get_bd_pins LTC2333_write_0/busy]
connect_bd_net [get_bd_pins xlconcat_2/dout] [get_bd_pins dout_0]

current_bd_instance /AXI_and_resets
connect_bd_intf_net [get_bd_intf_pins M00_AXI1] [get_bd_intf_pins axi_interconnect_0/M00_AXI]
connect_bd_intf_net [get_bd_intf_pins axi_interconnect_0/S00_AXI] [get_bd_intf_pins axi_cdma_0/M_AXI_SG]
connect_bd_intf_net [get_bd_intf_pins S00_AXI] [get_bd_intf_pins axi_interconnect_1/S00_AXI]
connect_bd_intf_net [get_bd_intf_pins M_AXI] [get_bd_intf_pins axi_cdma_0/M_AXI]
connect_bd_intf_net [get_bd_intf_pins M00_AXI] [get_bd_intf_pins axi_interconnect_1/M00_AXI]
connect_bd_intf_net [get_bd_intf_pins M01_AXI] [get_bd_intf_pins axi_interconnect_1/M01_AXI]
connect_bd_intf_net [get_bd_intf_pins M02_AXI] [get_bd_intf_pins axi_interconnect_1/M02_AXI]
connect_bd_intf_net [get_bd_intf_pins M03_AXI] [get_bd_intf_pins axi_interconnect_1/M03_AXI]
connect_bd_intf_net [get_bd_intf_pins M04_AXI] [get_bd_intf_pins axi_interconnect_1/M04_AXI]
connect_bd_intf_net [get_bd_intf_pins axi_interconnect_1/M05_AXI] [get_bd_intf_pins axi_cdma_0/S_AXI_LITE]
connect_bd_intf_net [get_bd_intf_pins M06_AXI] [get_bd_intf_pins axi_interconnect_1/M06_AXI]
connect_bd_net [get_bd_pins axi_cdma_0/cdma_introut] [get_bd_pins cdma_introut]
connect_bd_net -net processing_system7_0_FCLK_CLK0 [get_bd_pins S00_ACLK] \
  [get_bd_pins rst_ps7_0_100M/slowest_sync_clk] [get_bd_pins axi_interconnect_0/ACLK] \
  [get_bd_pins axi_interconnect_0/S00_ACLK] [get_bd_pins axi_interconnect_0/M00_ACLK] \
  [get_bd_pins axi_cdma_0/s_axi_lite_aclk] [get_bd_pins axi_cdma_0/m_axi_aclk] [get_bd_pins axi_interconnect_1/ACLK] \
  [get_bd_pins axi_interconnect_1/S00_ACLK] [get_bd_pins axi_interconnect_1/M00_ACLK] \
  [get_bd_pins axi_interconnect_1/M01_ACLK] [get_bd_pins axi_interconnect_1/M02_ACLK] \
  [get_bd_pins axi_interconnect_1/M03_ACLK] [get_bd_pins axi_interconnect_1/M04_ACLK] \
  [get_bd_pins axi_interconnect_1/M05_ACLK] [get_bd_pins axi_interconnect_1/M06_ACLK]
connect_bd_net -net processing_system7_0_FCLK_CLK1 [get_bd_pins slowest_sync_clk] [get_bd_pins rst_ps7_0_100M1/slowest_sync_clk]
connect_bd_net -net processing_system7_0_FCLK_RESET0_N [get_bd_pins ext_reset_in] \
  [get_bd_pins rst_ps7_0_100M1/ext_reset_in] [get_bd_pins rst_ps7_0_100M/ext_reset_in]
connect_bd_net [get_bd_pins rst_ps7_0_100M1/peripheral_aresetn] [get_bd_pins peripheral_aresetn]
connect_bd_net [get_bd_pins rst_ps7_0_100M1/peripheral_reset] [get_bd_pins peripheral_reset]
connect_bd_net [get_bd_pins rst_ps7_0_100M/peripheral_aresetn] \
  [get_bd_pins S00_ARESETN] [get_bd_pins axi_interconnect_0/ARESETN] [get_bd_pins axi_interconnect_0/S00_ARESETN] \
  [get_bd_pins axi_interconnect_0/M00_ARESETN] [get_bd_pins axi_cdma_0/s_axi_lite_aresetn] \
  [get_bd_pins axi_interconnect_1/M04_ARESETN] [get_bd_pins axi_interconnect_1/M03_ARESETN] \
  [get_bd_pins axi_interconnect_1/M02_ARESETN] [get_bd_pins axi_interconnect_1/M01_ARESETN] \
  [get_bd_pins axi_interconnect_1/M00_ARESETN] [get_bd_pins axi_interconnect_1/S00_ARESETN] \
  [get_bd_pins axi_interconnect_1/ARESETN] [get_bd_pins axi_interconnect_1/M05_ARESETN] \
  [get_bd_pins axi_interconnect_1/M06_ARESETN]

current_bd_instance /LTC2333_read
connect_bd_intf_net [get_bd_intf_pins AXI_Full_IPIF_0/IP] [get_bd_intf_pins LTCTimer_0/FIFO]
connect_bd_intf_net [get_bd_intf_pins M08_AXI] [get_bd_intf_pins ps7_0_axi_periph1/M08_AXI]
connect_bd_intf_net [get_bd_intf_pins S00_AXI1] [get_bd_intf_pins ps7_0_axi_periph1/S00_AXI]
connect_bd_intf_net [get_bd_intf_pins S00_AXI] [get_bd_intf_pins axi_to_ipif_mux_0/S_AXI]
connect_bd_intf_net [get_bd_intf_pins axi_to_ipif_mux_0/IPIF_C00] [get_bd_intf_pins LTC233_read_block_0/IPIF]
connect_bd_intf_net [get_bd_intf_pins axi_to_ipif_mux_0/IPIF_C01] [get_bd_intf_pins LTC233_read_block_1/IPIF]
connect_bd_intf_net [get_bd_intf_pins axi_to_ipif_mux_0/IPIF_C02] [get_bd_intf_pins LTC233_read_block_2/IPIF]
connect_bd_intf_net [get_bd_intf_pins axi_to_ipif_mux_0/IPIF_C03] [get_bd_intf_pins LTC233_read_block_3/IPIF]
connect_bd_intf_net [get_bd_intf_pins axi_to_ipif_mux_0/IPIF_C04] [get_bd_intf_pins LTC233_read_block_4/IPIF]
connect_bd_intf_net [get_bd_intf_pins axi_to_ipif_mux_0/IPIF_C05] [get_bd_intf_pins LTC233_read_block_5/IPIF]
connect_bd_intf_net [get_bd_intf_pins axi_to_ipif_mux_0/IPIF_C06] [get_bd_intf_pins LTC233_read_block_6/IPIF]
connect_bd_intf_net [get_bd_intf_pins axi_to_ipif_mux_0/IPIF_C07] [get_bd_intf_pins LTC233_read_block_7/IPIF]
connect_bd_intf_net [get_bd_intf_pins axi_to_ipif_mux_0/IPIF_C08] [get_bd_intf_pins LTCTimer_0/IPIF]
connect_bd_intf_net [get_bd_intf_pins ps7_0_axi_periph1/M00_AXI] [get_bd_intf_pins LTC233_read_block_1/S00_AXI]
connect_bd_intf_net [get_bd_intf_pins ps7_0_axi_periph1/M01_AXI] [get_bd_intf_pins LTC233_read_block_2/S00_AXI]
connect_bd_intf_net [get_bd_intf_pins ps7_0_axi_periph1/M02_AXI] [get_bd_intf_pins LTC233_read_block_3/S00_AXI]
connect_bd_intf_net [get_bd_intf_pins ps7_0_axi_periph1/M03_AXI] [get_bd_intf_pins LTC233_read_block_4/S00_AXI]
connect_bd_intf_net [get_bd_intf_pins ps7_0_axi_periph1/M04_AXI] [get_bd_intf_pins LTC233_read_block_5/S00_AXI]
connect_bd_intf_net [get_bd_intf_pins ps7_0_axi_periph1/M05_AXI] [get_bd_intf_pins LTC233_read_block_0/S00_AXI]
connect_bd_intf_net [get_bd_intf_pins ps7_0_axi_periph1/M06_AXI] [get_bd_intf_pins LTC233_read_block_7/S00_AXI]
connect_bd_intf_net [get_bd_intf_pins ps7_0_axi_periph1/M07_AXI] [get_bd_intf_pins LTC233_read_block_6/S00_AXI]
connect_bd_intf_net [get_bd_intf_pins ps7_0_axi_periph1/M09_AXI] [get_bd_intf_pins AXI_Full_IPIF_0/S00_AXI]
connect_bd_intf_net [get_bd_intf_pins s_axi] [get_bd_intf_pins axi_intc_0/s_axi]
connect_bd_net -net Din_1 [get_bd_pins util_ds_buf_0/IBUF_OUT] \
  [get_bd_pins LTC233_read_block_0/Din] [get_bd_pins LTC233_read_block_2/Din] [get_bd_pins LTC233_read_block_1/Din] \
  [get_bd_pins LTC233_read_block_3/Din] [get_bd_pins LTC233_read_block_4/Din] [get_bd_pins LTC233_read_block_5/Din] \
  [get_bd_pins LTC233_read_block_6/Din] [get_bd_pins LTC233_read_block_7/Din]
connect_bd_net -net LTC2333_write_0_cnv [get_bd_pins cnv_0] \
  [get_bd_pins LTC233_read_block_1/cnv_0] [get_bd_pins LTC233_read_block_2/cnv_0] [get_bd_pins LTC233_read_block_3/cnv_0] \
  [get_bd_pins LTC233_read_block_4/cnv_0] [get_bd_pins LTC233_read_block_5/cnv_0] [get_bd_pins LTC233_read_block_6/cnv_0] \
  [get_bd_pins LTC233_read_block_7/cnv_0] [get_bd_pins LTC233_read_block_0/cnv_0] [get_bd_pins LTCTimer_0/cnv]
connect_bd_net [get_bd_pins LTC233_read_block_0/FIFO_full] [get_bd_pins xlconcat_0/In0]
connect_bd_net [get_bd_pins LTC233_read_block_0/interrupt] [get_bd_pins xlconcat_1/In6]
connect_bd_net [get_bd_pins LTC233_read_block_0/time_we] [get_bd_pins xlconcat_2/In6]
connect_bd_net [get_bd_pins LTC233_read_block_1/FIFO_full] [get_bd_pins xlconcat_0/In1]
connect_bd_net [get_bd_pins LTC233_read_block_1/interrupt] [get_bd_pins xlconcat_1/In0]
connect_bd_net [get_bd_pins LTC233_read_block_1/time_we] [get_bd_pins xlconcat_2/In0]
connect_bd_net [get_bd_pins LTC233_read_block_2/FIFO_full] [get_bd_pins xlconcat_0/In2]
connect_bd_net [get_bd_pins LTC233_read_block_2/interrupt] [get_bd_pins xlconcat_1/In2]
connect_bd_net [get_bd_pins LTC233_read_block_2/time_we] [get_bd_pins xlconcat_2/In1]
connect_bd_net [get_bd_pins LTC233_read_block_3/FIFO_full] [get_bd_pins xlconcat_0/In3]
connect_bd_net [get_bd_pins LTC233_read_block_3/interrupt] [get_bd_pins xlconcat_1/In1]
connect_bd_net [get_bd_pins LTC233_read_block_3/time_we] [get_bd_pins xlconcat_2/In2]
connect_bd_net [get_bd_pins LTC233_read_block_4/FIFO_full] [get_bd_pins xlconcat_0/In4]
connect_bd_net [get_bd_pins LTC233_read_block_4/interrupt] [get_bd_pins xlconcat_1/In3]
connect_bd_net [get_bd_pins LTC233_read_block_4/time_we] [get_bd_pins xlconcat_2/In5]
connect_bd_net [get_bd_pins LTC233_read_block_5/FIFO_full] [get_bd_pins xlconcat_0/In5]
connect_bd_net [get_bd_pins LTC233_read_block_5/interrupt] [get_bd_pins xlconcat_1/In4]
connect_bd_net [get_bd_pins LTC233_read_block_5/time_we] [get_bd_pins xlconcat_2/In3]
connect_bd_net [get_bd_pins LTC233_read_block_6/FIFO_full] [get_bd_pins xlconcat_0/In7]
connect_bd_net [get_bd_pins LTC233_read_block_6/interrupt] [get_bd_pins xlconcat_1/In5]
connect_bd_net [get_bd_pins LTC233_read_block_6/time_we] [get_bd_pins xlconcat_2/In4]
connect_bd_net [get_bd_pins LTC233_read_block_7/FIFO_full] [get_bd_pins xlconcat_0/In6]
connect_bd_net [get_bd_pins LTC233_read_block_7/interrupt] [get_bd_pins xlconcat_1/In7]
connect_bd_net [get_bd_pins LTC233_read_block_7/time_we] [get_bd_pins xlconcat_2/In7]
connect_bd_net [get_bd_pins LTCTimer_0/FIFO_full] [get_bd_pins xlconcat_0/In8]
connect_bd_net [get_bd_pins LTCTimer_0/interrupt] [get_bd_pins xlconcat_1/In8]
connect_bd_net [get_bd_pins SCKO_N] [get_bd_pins util_ds_buf_0/IBUF_DS_N]
connect_bd_net [get_bd_pins SCKO_P] [get_bd_pins util_ds_buf_0/IBUF_DS_P]
connect_bd_net [get_bd_pins SDO_N] [get_bd_pins util_ds_buf_1/IBUF_DS_N]
connect_bd_net [get_bd_pins SDO_P] [get_bd_pins util_ds_buf_1/IBUF_DS_P]
connect_bd_net [get_bd_pins aresetn] \
  [get_bd_pins LTC233_read_block_0/aresetn] [get_bd_pins LTC233_read_block_1/aresetn] \
  [get_bd_pins LTC233_read_block_2/aresetn] [get_bd_pins LTC233_read_block_3/aresetn] \
  [get_bd_pins LTC233_read_block_4/aresetn] [get_bd_pins LTC233_read_block_5/aresetn] \
  [get_bd_pins LTC233_read_block_6/aresetn] [get_bd_pins LTC233_read_block_7/aresetn]
connect_bd_net [get_bd_pins axi_intc_0/irq] [get_bd_pins irq]
connect_bd_net -net processing_system7_0_FCLK_CLK0 [get_bd_pins FIFO_clk] \
  [get_bd_pins LTC233_read_block_0/FIFO_clk] [get_bd_pins LTC233_read_block_1/FIFO_clk] \
  [get_bd_pins LTC233_read_block_2/FIFO_clk] [get_bd_pins LTC233_read_block_3/FIFO_clk] \
  [get_bd_pins LTC233_read_block_4/FIFO_clk] [get_bd_pins LTC233_read_block_5/FIFO_clk] \
  [get_bd_pins LTC233_read_block_6/FIFO_clk] [get_bd_pins LTC233_read_block_7/FIFO_clk] \
  [get_bd_pins axi_to_ipif_mux_0/S_AXI_ACLK] [get_bd_pins ps7_0_axi_periph1/ACLK] [get_bd_pins ps7_0_axi_periph1/M00_ACLK] \
  [get_bd_pins ps7_0_axi_periph1/M01_ACLK] [get_bd_pins ps7_0_axi_periph1/M02_ACLK] [get_bd_pins ps7_0_axi_periph1/M03_ACLK] \
  [get_bd_pins ps7_0_axi_periph1/M04_ACLK] [get_bd_pins ps7_0_axi_periph1/M05_ACLK] [get_bd_pins ps7_0_axi_periph1/M06_ACLK] \
  [get_bd_pins ps7_0_axi_periph1/M07_ACLK] [get_bd_pins ps7_0_axi_periph1/S00_ACLK] [get_bd_pins ps7_0_axi_periph1/M08_ACLK] \
  [get_bd_pins AXI_Full_IPIF_0/s00_axi_aclk] [get_bd_pins ps7_0_axi_periph1/M09_ACLK] [get_bd_pins axi_intc_0/s_axi_aclk] \
  [get_bd_pins LTCTimer_0/IPIF_clk] [get_bd_pins LTCTimer_0/FIFO_clk]
connect_bd_net -net processing_system7_0_FCLK_CLK1 [get_bd_pins clk] \
  [get_bd_pins LTC233_read_block_1/clk] [get_bd_pins LTC233_read_block_2/clk] [get_bd_pins LTC233_read_block_3/clk] \
  [get_bd_pins LTC233_read_block_4/clk] [get_bd_pins LTC233_read_block_5/clk] [get_bd_pins LTC233_read_block_6/clk] \
  [get_bd_pins LTC233_read_block_7/clk] [get_bd_pins LTC233_read_block_0/clk] [get_bd_pins LTCTimer_0/clk]
connect_bd_net -net rst_ps7_0_100M_peripheral_aresetn [get_bd_pins s00_axi_aresetn] \
  [get_bd_pins LTC233_read_block_0/s00_axi_aresetn] [get_bd_pins LTC233_read_block_1/s00_axi_aresetn] \
  [get_bd_pins LTC233_read_block_2/s00_axi_aresetn] [get_bd_pins LTC233_read_block_3/s00_axi_aresetn] \
  [get_bd_pins LTC233_read_block_4/s00_axi_aresetn] [get_bd_pins LTC233_read_block_5/s00_axi_aresetn] \
  [get_bd_pins LTC233_read_block_6/s00_axi_aresetn] [get_bd_pins LTC233_read_block_7/s00_axi_aresetn] \
  [get_bd_pins axi_to_ipif_mux_0/S_AXI_ARESETN] [get_bd_pins ps7_0_axi_periph1/ARESETN] \
  [get_bd_pins ps7_0_axi_periph1/M00_ARESETN] [get_bd_pins ps7_0_axi_periph1/M01_ARESETN] \
  [get_bd_pins ps7_0_axi_periph1/M02_ARESETN] [get_bd_pins ps7_0_axi_periph1/M03_ARESETN] \
  [get_bd_pins ps7_0_axi_periph1/M04_ARESETN] [get_bd_pins ps7_0_axi_periph1/M05_ARESETN] \
  [get_bd_pins ps7_0_axi_periph1/M06_ARESETN] [get_bd_pins ps7_0_axi_periph1/M07_ARESETN] \
  [get_bd_pins ps7_0_axi_periph1/S00_ARESETN] [get_bd_pins ps7_0_axi_periph1/M08_ARESETN] \
  [get_bd_pins AXI_Full_IPIF_0/s00_axi_aresetn] [get_bd_pins ps7_0_axi_periph1/M09_ARESETN] \
  [get_bd_pins axi_intc_0/s_axi_aresetn] [get_bd_pins LTCTimer_0/aresetn]
connect_bd_net [get_bd_pins timetrig] \
  [get_bd_pins LTC233_read_block_0/timetrig] [get_bd_pins LTC233_read_block_2/timetrig] \
  [get_bd_pins LTC233_read_block_1/timetrig] [get_bd_pins LTC233_read_block_3/timetrig] \
  [get_bd_pins LTC233_read_block_4/timetrig] [get_bd_pins LTC233_read_block_5/timetrig] \
  [get_bd_pins LTC233_read_block_6/timetrig] [get_bd_pins LTC233_read_block_7/timetrig]
connect_bd_net [get_bd_pins util_ds_buf_1/IBUF_OUT] \
  [get_bd_pins LTC233_read_block_0/Din1] [get_bd_pins LTC233_read_block_2/Din1] [get_bd_pins LTC233_read_block_1/Din1] \
  [get_bd_pins LTC233_read_block_3/Din1] [get_bd_pins LTC233_read_block_4/Din1] [get_bd_pins LTC233_read_block_5/Din1] \
  [get_bd_pins LTC233_read_block_6/Din1] [get_bd_pins LTC233_read_block_7/Din1]
connect_bd_net [get_bd_pins util_reduced_logic_0/Res] \
  [get_bd_pins LTC233_read_block_0/FIFO_write_block] [get_bd_pins LTC233_read_block_1/FIFO_write_block] \
  [get_bd_pins LTC233_read_block_2/FIFO_write_block] [get_bd_pins LTC233_read_block_3/FIFO_write_block] \
  [get_bd_pins LTC233_read_block_4/FIFO_write_block] [get_bd_pins LTC233_read_block_5/FIFO_write_block] \
  [get_bd_pins LTC233_read_block_7/FIFO_write_block] [get_bd_pins LTC233_read_block_6/FIFO_write_block] \
  [get_bd_pins LTCTimer_0/FIFO_write_block]
connect_bd_net [get_bd_pins xlconcat_0/dout] [get_bd_pins util_reduced_logic_0/Op1]
connect_bd_net [get_bd_pins xlconcat_1/dout] [get_bd_pins axi_intc_0/intr]
connect_bd_net [get_bd_pins xlconcat_2/dout] [get_bd_pins LTCTimer_0/time_we]

current_bd_instance /LTC2333_read/LTC233_read_block_0
connect_bd_intf_net [get_bd_intf_pins AXI_Full_IPIF_0/IP] [get_bd_intf_pins LTC2333_read_0/FIFO]
connect_bd_intf_net [get_bd_intf_pins IPIF] [get_bd_intf_pins LTC2333_read_0/IPIF]
connect_bd_intf_net [get_bd_intf_pins S00_AXI] [get_bd_intf_pins AXI_Full_IPIF_0/S00_AXI]
connect_bd_net -net Din1_1 [get_bd_pins Din1] [get_bd_pins xlslice_8/Din]
connect_bd_net [get_bd_pins Din] [get_bd_pins xlslice_7/Din]
connect_bd_net [get_bd_pins FIFO_write_block] [get_bd_pins LTC2333_read_0/FIFO_write_block]
connect_bd_net [get_bd_pins LTC2333_read_0/FIFO_full] [get_bd_pins FIFO_full]
connect_bd_net [get_bd_pins LTC2333_read_0/interrupt] [get_bd_pins interrupt]
connect_bd_net [get_bd_pins LTC2333_read_0/time_we] [get_bd_pins time_we]
connect_bd_net -net LTC2333_write_0_cnv [get_bd_pins cnv_0] [get_bd_pins LTC2333_read_0/cnv]
connect_bd_net [get_bd_pins aresetn] [get_bd_pins LTC2333_read_0/aresetn]
connect_bd_net -net processing_system7_0_FCLK_CLK0 [get_bd_pins FIFO_clk] \
  [get_bd_pins AXI_Full_IPIF_0/s00_axi_aclk] [get_bd_pins LTC2333_read_0/IPIF_clk] [get_bd_pins LTC2333_read_0/FIFO_clk]
connect_bd_net -net processing_system7_0_FCLK_CLK1 [get_bd_pins clk] [get_bd_pins LTC2333_read_0/clk]
connect_bd_net [get_bd_pins s00_axi_aresetn] [get_bd_pins AXI_Full_IPIF_0/s00_axi_aresetn]
connect_bd_net [get_bd_pins timetrig] [get_bd_pins LTC2333_read_0/timetrig]
connect_bd_net [get_bd_pins xlslice_7/Dout] [get_bd_pins LTC2333_read_0/scko]
connect_bd_net [get_bd_pins xlslice_8/Dout] [get_bd_pins LTC2333_read_0/sdo]

current_bd_instance /LTC2333_read/LTC233_read_block_2
connect_bd_intf_net [get_bd_intf_pins AXI_Full_IPIF_0/IP] [get_bd_intf_pins LTC2333_read_0/FIFO]
connect_bd_intf_net [get_bd_intf_pins IPIF] [get_bd_intf_pins LTC2333_read_0/IPIF]
connect_bd_intf_net [get_bd_intf_pins S00_AXI] [get_bd_intf_pins AXI_Full_IPIF_0/S00_AXI]
connect_bd_net -net Din1_1 [get_bd_pins Din1] [get_bd_pins xlslice_9/Din]
connect_bd_net [get_bd_pins Din] [get_bd_pins xlslice_4/Din]
connect_bd_net [get_bd_pins FIFO_write_block] [get_bd_pins LTC2333_read_0/FIFO_write_block]
connect_bd_net [get_bd_pins LTC2333_read_0/FIFO_full] [get_bd_pins FIFO_full]
connect_bd_net [get_bd_pins LTC2333_read_0/interrupt] [get_bd_pins interrupt]
connect_bd_net [get_bd_pins LTC2333_read_0/time_we] [get_bd_pins time_we]
connect_bd_net -net LTC2333_write_0_cnv [get_bd_pins cnv_0] [get_bd_pins LTC2333_read_0/cnv]
connect_bd_net [get_bd_pins aresetn] [get_bd_pins LTC2333_read_0/aresetn]
connect_bd_net -net processing_system7_0_FCLK_CLK0 [get_bd_pins FIFO_clk] \
  [get_bd_pins AXI_Full_IPIF_0/s00_axi_aclk] [get_bd_pins LTC2333_read_0/IPIF_clk] [get_bd_pins LTC2333_read_0/FIFO_clk]
connect_bd_net -net processing_system7_0_FCLK_CLK1 [get_bd_pins clk] [get_bd_pins LTC2333_read_0/clk]
connect_bd_net [get_bd_pins s00_axi_aresetn] [get_bd_pins AXI_Full_IPIF_0/s00_axi_aresetn]
connect_bd_net [get_bd_pins timetrig] [get_bd_pins LTC2333_read_0/timetrig]
connect_bd_net [get_bd_pins xlslice_4/Dout] [get_bd_pins LTC2333_read_0/scko]
connect_bd_net [get_bd_pins xlslice_9/Dout] [get_bd_pins LTC2333_read_0/sdo]

current_bd_instance /LTC2333_read/LTC233_read_block_3
connect_bd_intf_net [get_bd_intf_pins AXI_Full_IPIF_0/IP] [get_bd_intf_pins LTC2333_read_0/FIFO]
connect_bd_intf_net [get_bd_intf_pins IPIF] [get_bd_intf_pins LTC2333_read_0/IPIF]
connect_bd_intf_net [get_bd_intf_pins S00_AXI] [get_bd_intf_pins AXI_Full_IPIF_0/S00_AXI]
connect_bd_net -net Din1_1 [get_bd_pins Din1] [get_bd_pins xlslice_11/Din]
connect_bd_net [get_bd_pins Din] [get_bd_pins xlslice_2/Din]
connect_bd_net [get_bd_pins FIFO_write_block] [get_bd_pins LTC2333_read_0/FIFO_write_block]
connect_bd_net [get_bd_pins LTC2333_read_0/FIFO_full] [get_bd_pins FIFO_full]
connect_bd_net [get_bd_pins LTC2333_read_0/interrupt] [get_bd_pins interrupt]
connect_bd_net [get_bd_pins LTC2333_read_0/time_we] [get_bd_pins time_we]
connect_bd_net -net LTC2333_write_0_cnv [get_bd_pins cnv_0] [get_bd_pins LTC2333_read_0/cnv]
connect_bd_net [get_bd_pins aresetn] [get_bd_pins LTC2333_read_0/aresetn]
connect_bd_net -net processing_system7_0_FCLK_CLK0 [get_bd_pins FIFO_clk] \
  [get_bd_pins AXI_Full_IPIF_0/s00_axi_aclk] [get_bd_pins LTC2333_read_0/IPIF_clk] [get_bd_pins LTC2333_read_0/FIFO_clk]
connect_bd_net -net processing_system7_0_FCLK_CLK1 [get_bd_pins clk] [get_bd_pins LTC2333_read_0/clk]
connect_bd_net [get_bd_pins s00_axi_aresetn] [get_bd_pins AXI_Full_IPIF_0/s00_axi_aresetn]
connect_bd_net [get_bd_pins timetrig] [get_bd_pins LTC2333_read_0/timetrig]
connect_bd_net [get_bd_pins xlslice_11/Dout] [get_bd_pins LTC2333_read_0/sdo]
connect_bd_net [get_bd_pins xlslice_2/Dout] [get_bd_pins LTC2333_read_0/scko]

current_bd_instance /LTC2333_read/LTC233_read_block_4
connect_bd_intf_net [get_bd_intf_pins AXI_Full_IPIF_0/IP] [get_bd_intf_pins LTC2333_read_0/FIFO]
connect_bd_intf_net [get_bd_intf_pins IPIF] [get_bd_intf_pins LTC2333_read_0/IPIF]
connect_bd_intf_net [get_bd_intf_pins S00_AXI] [get_bd_intf_pins AXI_Full_IPIF_0/S00_AXI]
connect_bd_net -net Din1_1 [get_bd_pins Din1] [get_bd_pins xlslice_12/Din]
connect_bd_net [get_bd_pins Din] [get_bd_pins xlslice_5/Din]
connect_bd_net [get_bd_pins FIFO_write_block] [get_bd_pins LTC2333_read_0/FIFO_write_block]
connect_bd_net [get_bd_pins LTC2333_read_0/FIFO_full] [get_bd_pins FIFO_full]
connect_bd_net [get_bd_pins LTC2333_read_0/interrupt] [get_bd_pins interrupt]
connect_bd_net [get_bd_pins LTC2333_read_0/time_we] [get_bd_pins time_we]
connect_bd_net -net LTC2333_write_0_cnv [get_bd_pins cnv_0] [get_bd_pins LTC2333_read_0/cnv]
connect_bd_net [get_bd_pins aresetn] [get_bd_pins LTC2333_read_0/aresetn]
connect_bd_net -net processing_system7_0_FCLK_CLK0 [get_bd_pins FIFO_clk] \
  [get_bd_pins AXI_Full_IPIF_0/s00_axi_aclk] [get_bd_pins LTC2333_read_0/IPIF_clk] [get_bd_pins LTC2333_read_0/FIFO_clk]
connect_bd_net -net processing_system7_0_FCLK_CLK1 [get_bd_pins clk] [get_bd_pins LTC2333_read_0/clk]
connect_bd_net [get_bd_pins s00_axi_aresetn] [get_bd_pins AXI_Full_IPIF_0/s00_axi_aresetn]
connect_bd_net [get_bd_pins timetrig] [get_bd_pins LTC2333_read_0/timetrig]
connect_bd_net [get_bd_pins xlslice_12/Dout] [get_bd_pins LTC2333_read_0/sdo]
connect_bd_net [get_bd_pins xlslice_5/Dout] [get_bd_pins LTC2333_read_0/scko]

current_bd_instance /LTC2333_read/LTC233_read_block_5
connect_bd_intf_net [get_bd_intf_pins AXI_Full_IPIF_0/IP] [get_bd_intf_pins LTC2333_read_0/FIFO]
connect_bd_intf_net [get_bd_intf_pins IPIF] [get_bd_intf_pins LTC2333_read_0/IPIF]
connect_bd_intf_net [get_bd_intf_pins S00_AXI] [get_bd_intf_pins AXI_Full_IPIF_0/S00_AXI]
connect_bd_net -net Din1_1 [get_bd_pins Din1] [get_bd_pins xlslice_13/Din]
connect_bd_net [get_bd_pins Din] [get_bd_pins xlslice_6/Din]
connect_bd_net [get_bd_pins FIFO_write_block] [get_bd_pins LTC2333_read_0/FIFO_write_block]
connect_bd_net [get_bd_pins LTC2333_read_0/FIFO_full] [get_bd_pins FIFO_full]
connect_bd_net [get_bd_pins LTC2333_read_0/interrupt] [get_bd_pins interrupt]
connect_bd_net [get_bd_pins LTC2333_read_0/time_we] [get_bd_pins time_we]
connect_bd_net -net LTC2333_write_0_cnv [get_bd_pins cnv_0] [get_bd_pins LTC2333_read_0/cnv]
connect_bd_net [get_bd_pins aresetn] [get_bd_pins LTC2333_read_0/aresetn]
connect_bd_net -net processing_system7_0_FCLK_CLK0 [get_bd_pins FIFO_clk] \
  [get_bd_pins AXI_Full_IPIF_0/s00_axi_aclk] [get_bd_pins LTC2333_read_0/IPIF_clk] [get_bd_pins LTC2333_read_0/FIFO_clk]
connect_bd_net -net processing_system7_0_FCLK_CLK1 [get_bd_pins clk] [get_bd_pins LTC2333_read_0/clk]
connect_bd_net [get_bd_pins s00_axi_aresetn] [get_bd_pins AXI_Full_IPIF_0/s00_axi_aresetn]
connect_bd_net [get_bd_pins timetrig] [get_bd_pins LTC2333_read_0/timetrig]
connect_bd_net [get_bd_pins xlslice_13/Dout] [get_bd_pins LTC2333_read_0/sdo]
connect_bd_net [get_bd_pins xlslice_6/Dout] [get_bd_pins LTC2333_read_0/scko]
